# EAGLE schematic SchESP32 (EAGLE 6.5.0)
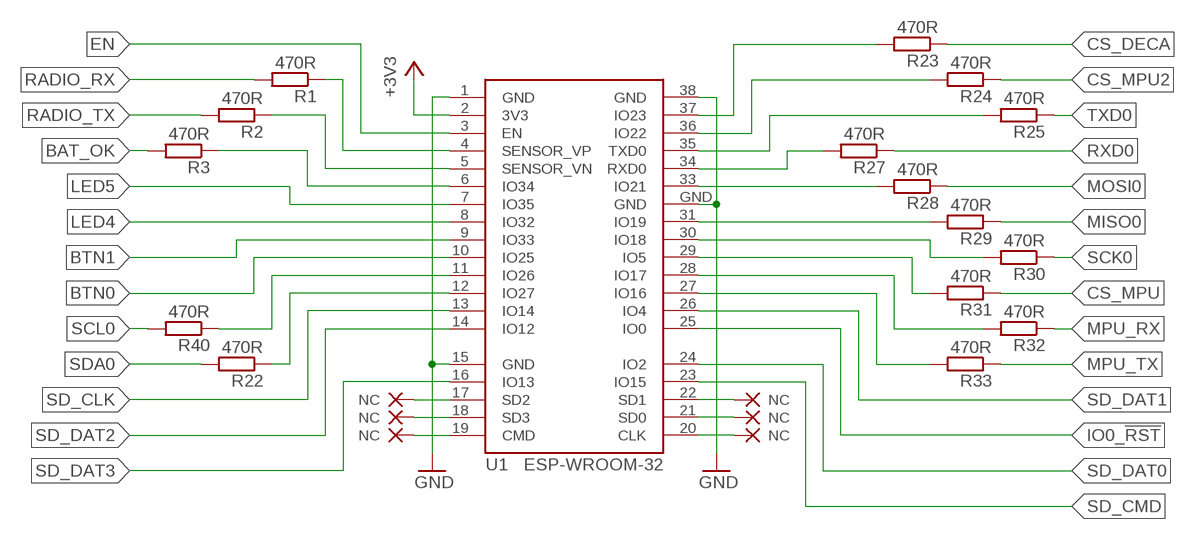
[diagram p0: schematic, sheet 1]

## Parts
NC1  NC  (no package)
NC2  NC  (no package)
NC4  NC  (no package)
NC5  NC  (no package)
NC6  NC  (no package)
NC7  NC  (no package)
R1  470R  R-EU_R0603  [R0603]
R2  470R  R-EU_R0603  [R0603]
R3  470R  R-EU_R0603  [R0603]
R22  470R  R-EU_R0603  [R0603]
R23  470R  R-EU_R0603  [R0603]
R24  470R  R-EU_R0603  [R0603]
R25  470R  R-EU_R0603  [R0603]
R27  470R  R-EU_R0603  [R0603]
R28  470R  R-EU_R0603  [R0603]
R29  470R  R-EU_R0603  [R0603]
R30  470R  R-EU_R0603  [R0603]
R31  470R  R-EU_R0603  [R0603]
R32  470R  R-EU_R0603  [R0603]
R33  470R  R-EU_R0603  [R0603]
R40  470R  R-EU_R0603  [R0603]
U1  ESP-WROOM-32  [ESP-WROOM-32]

## Nets
+3V3: U1.2(3V3)
BAT_OK: R3.2
BTN0: U1.10(IO25)
BTN1: U1.9(IO33)
CS_DECA: R23.1
CS_MPU: R31.1
CS_MPU2: R24.1
EN: U1.3(EN)
GND: U1.1(GND) U1.15(GND) U1.38(GND) U1.GND
IO0_!RST: U1.25(IO0)
IO5: R31.2 U1.29(IO5)
IO16: R33.2 U1.27(IO16)
IO17: R32.2 U1.28(IO17)
IO18: R30.2 U1.30(IO18)
IO19: R29.2 U1.31(IO19)
IO21: R28.2 U1.33(IO21)
IO22: R24.2 U1.36(IO22)
IO23: R23.2 U1.37(IO23)
IO26: R40.1 U1.11(IO26)
IO27: R22.1 U1.12(IO27)
IO34: R3.1 U1.6(IO34)
LED4: U1.8(IO32)
LED5: U1.7(IO35)
MISO0: R29.1
MOSI0: R28.1
MPU_RX: R32.1
MPU_TX: R33.1
N$35: NC5.NC U1.17(SD2)
N$36: NC6.NC U1.18(SD3)
N$37: NC7.NC U1.19(CMD)
N$38: NC1.NC U1.22(SD1)
N$39: NC2.NC U1.21(SD0)
N$40: NC4.NC U1.20(CLK)
RADIO_RX: R1.2
RADIO_TX: R2.2
RXD0: R27.1
RXD0_: R27.2 U1.34(RXD0)
SCK0: R30.1
SCL0: R40.2
SD_CLK: U1.13(IO14)
SD_CMD: U1.23(IO15)
SD_DAT0: U1.24(IO2)
SD_DAT1: U1.26(IO4)
SD_DAT2: U1.14(IO12)
SD_DAT3: U1.16(IO13)
SDA0: R22.2
SENSOR_VN_: R2.1 U1.5(SENSOR_VN)
SENSOR_VP_: R1.1 U1.4(SENSOR_VP)
TXD0: R25.1
TXD0_: R25.2 U1.35(TXD0)

## Library data of the parts
NC1 NC2 NC4-NC7 = NC:NC: _EXTERNAL_
R1-R3 R22-R25 R27-R33 R40 = rcl_upravena:R-EU_: RESISTOR, European symbol
U1 = esp32:ESP-WROOM-32: Espressif Systems ESP-WROOM-32